# Altium schematic sheet RX.SchDoc
size 594 x 420 mm; SheetNumber: 1; SheetTotal: 1; DocumentName: Sheet1.SCHDOC
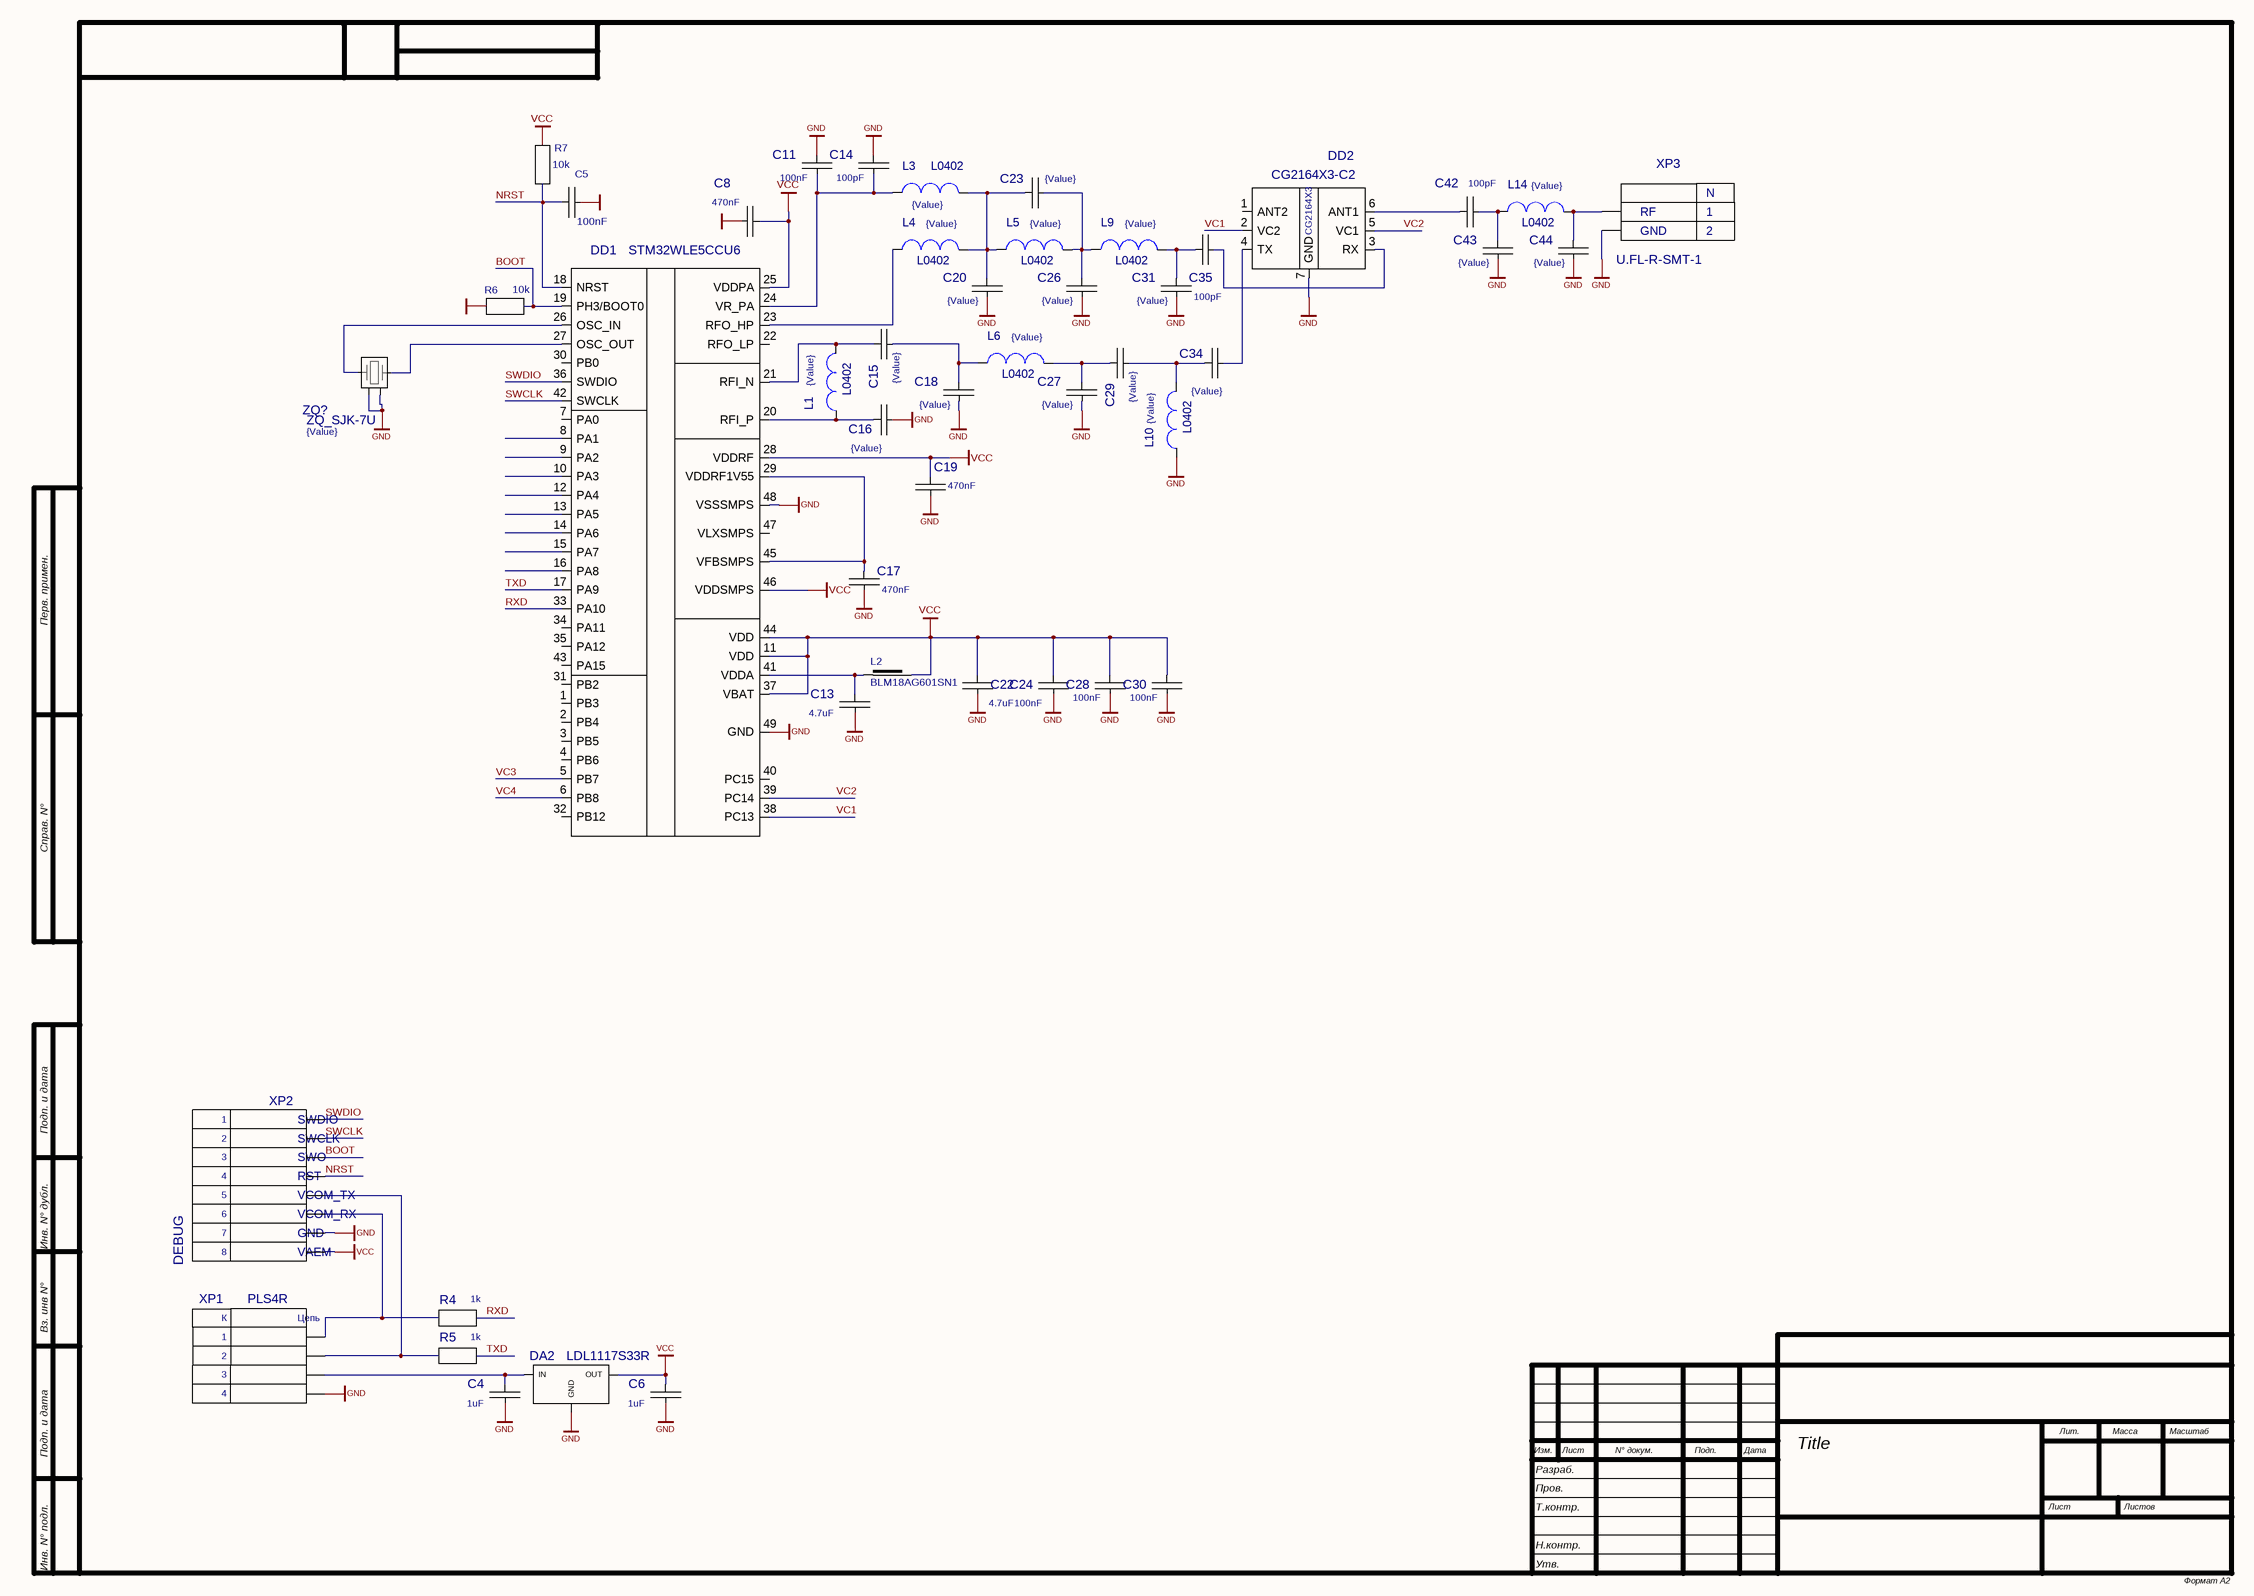
[diagram p0: RX.SchDoc]

## Parts
C4  value 1uF  [C0805]  (hidden comment: C0805)
C5  value 100nF  [C0402]  (hidden comment: C0402)
C6  value 1uF  [C0805]  (hidden comment: C0805)
C8  value 470nF  [C0603]  (hidden comment: C0603)
C11  value 100nF  [C0402]  (hidden comment: C0402)
C13  value 4.7uF  [C0603]  (hidden comment: C0603)
C14  value 100pF  [C0402]  (hidden comment: C0402)
C15  value {Value}  [C0402]  (hidden comment: C0402)
C16  value {Value}  [C0402]  (hidden comment: C0402)
C17  value 470nF  [C0603]  (hidden comment: C0603)
C18  value {Value}  [C0402]  (hidden comment: C0402)
C19  value 470nF  [C0603]  (hidden comment: C0603)
C20  value {Value}  [C0402]  (hidden comment: C0402)
C22  value 4.7uF  [C0603]  (hidden comment: C0603)
C23  value {Value}  [C0402]  (hidden comment: C0402)
C24  value 100nF  [C0402]  (hidden comment: C0402)
C26  value {Value}  [C0402]  (hidden comment: C0402)
C27  value {Value}  [C0402]  (hidden comment: C0402)
C28  value 100nF  [C0402]  (hidden comment: C0402)
C29  value {Value}  [C0402]  (hidden comment: C0402)
C30  value 100nF  [C0402]  (hidden comment: C0402)
C31  value {Value}  [C0402]  (hidden comment: C0402)
C34  value {Value}  [C0402]  (hidden comment: C0402)
C35  value 100pF  [C0402]  (hidden comment: C0402)
C42  value 100pF  [C0402]  (hidden comment: C0402)
C43  value {Value}  [C0402]  (hidden comment: C0402)
C44  value {Value}  [C0402]  (hidden comment: C0402)
DA2  LDL1117S33R  [SOT223]
DD1  STM32WLE5CCU6  [QFN48(7X7)]
DD2  CG2164X3-C2  [TSON-6]
L1  L0402  value {Value}  [L_0402]
L2  BLM18AG601SN1  [L0603]
L3  L0402  value {Value}  [L_0402]
L4  L0402  value {Value}  [L_0402]
L5  L0402  value {Value}  [L_0402]
L6  L0402  value {Value}  [L_0402]
L9  L0402  value {Value}  [L_0402]
L10  L0402  value {Value}  [L_0402]
L14  L0402  value {Value}  [L_0402]
R4  value 1k  [R0402]  (hidden comment: R0402)
R5  value 1k  [R0402]  (hidden comment: R0402)
R6  value 10k  [R0402]  (hidden comment: R0402)
R7  value 10k  [R0402]  (hidden comment: R0402)
XP1  PLS4R  [PLS4R]
XP2  PAD_4X2X2.5  [PAD_4X2X2.5]  (value not drawn)
XP3  U.FL-R-SMT-1  [U.FL-R-SMT-1]
ZQ?  ZQ_SJK-7U  value {Value}  [ZQ_3.2_2.5]

## Nets
GND: C4.2 C5.2 C6.2 C8.2 C11.1 C13.2 C14.1 C16.2 C17.2 C18.2 C19.2 C20.2 C22.2 C24.2 C26.2 C27.2 C28.2 C30.2 C31.2 C43.2 C44.2 DA2.1(GND) DD1.48(VSSSMPS) DD1.49(GND) DD2.7(GND) L10.1 R6.2 XP1.4 XP2.7 XP3.2 ZQ?.2 ZQ?.4
VCC: C6.1 C8.1 C19.1 C22.1 C24.1 C28.1 C30.1 DA2.2(OUT) DD1.11(VDD) DD1.25(VDDPA) DD1.28(VDDRF) DD1.37(VBAT) DD1.44(VDD) DD1.46(VDDSMPS) L2.2 R7.2 XP2.8
BOOT: DD1.19(PH3/BOOT0) R6.1 XP2.3
NRST: C5.1 DD1.18(NRST) R7.1 XP2.4
RXD: DD1.33(PA10) R4.2
SWCLK: DD1.42(SWCLK) XP2.2
SWDIO: DD1.36(SWDIO) XP2.1
TXD: DD1.17(PA9) R5.2
VC1: DD1.38(PC13) DD2.2(VC2)
VC2: DD1.39(PC14) DD2.5(VC1)
VC3: DD1.5(PB7)
VC4: DD1.6(PB8)
NetC4_1: C4.1 DA2.3(IN) XP1.3
NetC11_2: C11.2 C14.2 DD1.24(VR_PA) L3.1
NetC13_1: C13.1 DD1.41(VDDA) L2.1
NetC15_1: C15.1 DD1.21(RFI_N) L1.2
NetC15_2: C15.2 C18.1 L6.1
NetC16_1: C16.1 DD1.20(RFI_P) L1.1
NetC17_1: C17.1 DD1.29(VDDRF1V55) DD1.45(VFBSMPS)
NetC20_1: C20.1 C23.1 L3.2 L4.2 L5.1
NetC23_2: C23.2 C26.1 L5.2 L9.1
NetC27_1: C27.1 C29.1 L6.2
NetC29_2: C29.2 C34.1 L10.2
NetC31_1: C31.1 C35.1 L9.2
NetC34_2: C34.2 DD2.4(TX)
NetC35_2: C35.2 DD2.3(RX)
NetC42_1: C42.1 DD2.6(ANT1)
NetC42_2: C42.2 C43.1 L14.1
NetC44_1: C44.1 L14.2 XP3.1
NetDD1_23: DD1.23(RFO_HP) L4.1
NetDD1_26: DD1.26(OSC_IN) ZQ?.1
NetDD1_27: DD1.27(OSC_OUT) ZQ?.3
NetR4_1: R4.1 XP1.1 XP2.6
NetR5_1: R5.1 XP1.2 XP2.5

Not connected (* = marked no-connect by the designer): DA2 4; DD1 1(PB3) 2(PB4) 3(PB5) 4(PB6) 7(PA0) 8(PA1) 9(PA2) 10(PA3) 12(PA4) 13(PA5) 14(PA6) 15(PA7) 16(PA8) 22(RFO_LP) 30(PB0) 31(PB2) 32(PB12) 34(PA11) 35(PA12) 40(PC15) 43(PA15) 47(VLXSMPS); DD2 1(ANT2)

## Notes on the sheet
- (near XP2) SWDIO
- (near XP2) RST
- (near XP2) SWO
- (near XP2) SWCLK
- DEBUG
- (near XP2) VCOM_RX
- (near XP2) VCOM_TX
- (near XP2) VAEM
- (near XP2) GND
- Title
- Перв. примен.
- Справ. N°
- Подп. и дата
- Инв. N° дубл.
- Вз. инв N°
- Изм.
- Разраб.
- Лист
- N° докум.
- Подп.
- Дата
- Лит.
- Масса
- Масштаб
- Пров.
- Т.контр.
- Листов
- Н.контр.
- Утв.
- Инв. N° подл.
- Формат А2
- (in symbol CG2164X3-C2) CG2164X3
- (in symbol PLS4R) К; Цепь
- (in symbol U.FL-R-SMT-1) N; RF; GND

## Library data of the parts
C4 C6 = C0805: Mounting  Method: SMD
C5 C11 C14-C16 C18 C20 C23 C24 C26-C31 C34 C35 C42-C44 = C0402: Mounting  Method: SMD
C8 C13 C17 C19 C22 = C0603: Mounting  Method: SMD
DA2 = LDL1117S33R: Value: {Value}; Mounting  Method: SMD
DD1 = STM32WLE5CCU6: Value: {Value}; Mounting  Method: SMD
DD2 = CG2164X3-C2: Value: {Value}; Mounting  Method: SMD
L1 L3-L6 L9 L10 L14 = L0402: Mounting  Method: SMD
L2 = BEAD: Mounting  Method: SMD; Value: BLM18AG601SN1
R4-R7 = R0402: Mounting  Method: SMD
XP1 = PLS4R: Value: {Value}; Mounting  Method: THT
XP2 = PAD_4X2X2.5: Mounting  Method: SMD; Value: *
XP3 = U.FL-R-SMT-1: Value: {Value}; Mounting  Method: SMD
ZQ? = ZQ_SJK-7U: Mounting  Method: SMD